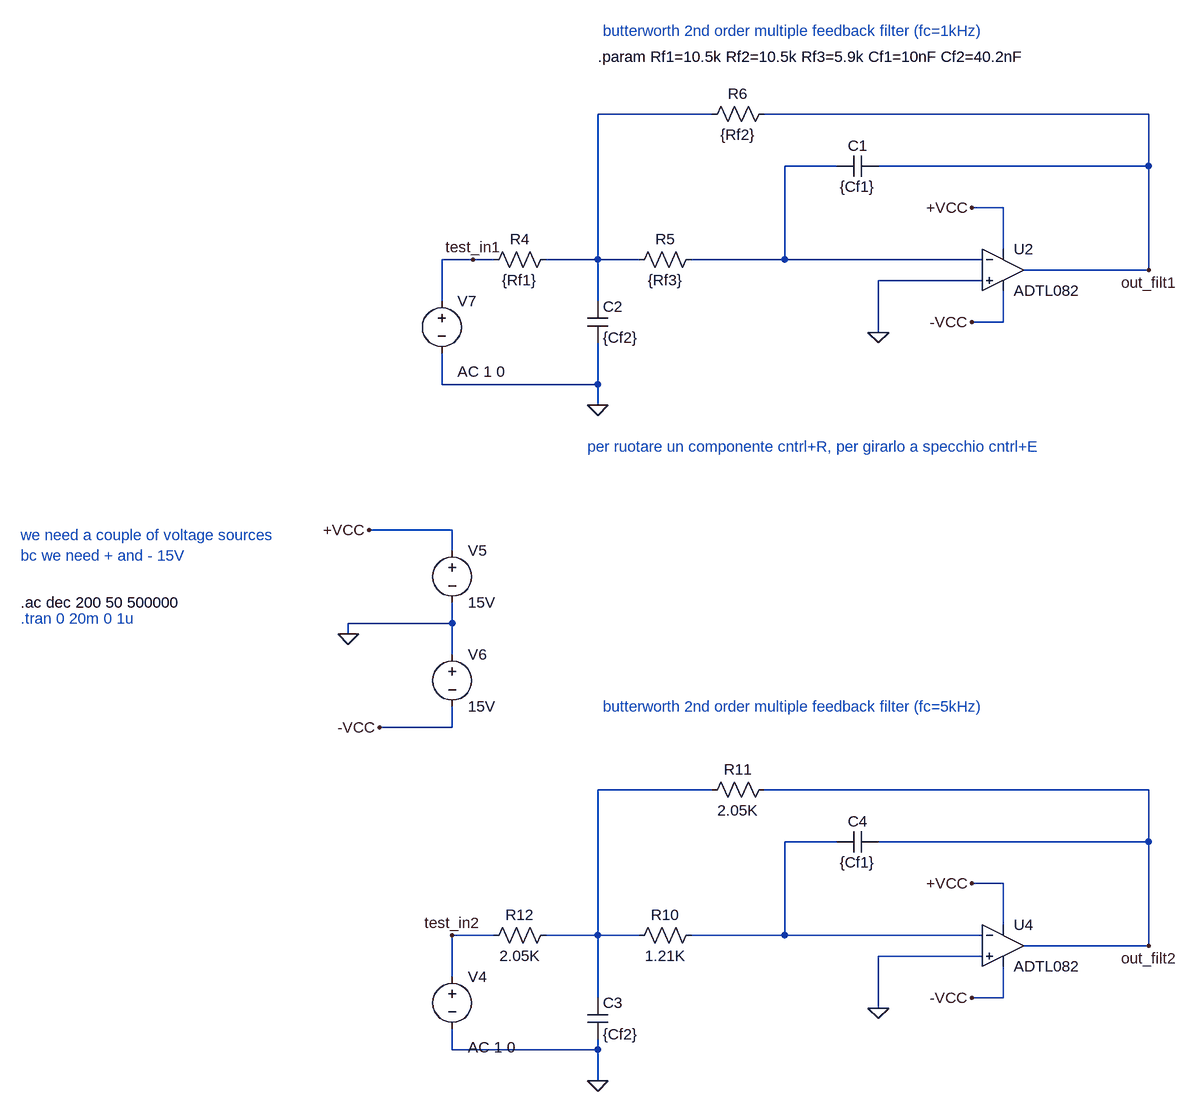
[diagram p0: schematic bode.asc]
bode.asc, the LTspice schematic file:
Version 4
SHEET 1 3368 1708
WIRE 1296 -144 1120 -144
WIRE 1968 -144 1376 -144
WIRE 1488 -64 1408 -64
WIRE 1968 -64 1968 -144
WIRE 1968 -64 1552 -64
WIRE 1744 0 1696 0
WIRE 1744 64 1744 0
WIRE 928 80 880 80
WIRE 960 80 928 80
WIRE 1120 80 1120 -144
WIRE 1120 80 1040 80
WIRE 1184 80 1120 80
WIRE 1408 80 1408 -64
WIRE 1408 80 1264 80
WIRE 1712 80 1408 80
WIRE 1968 96 1968 -64
WIRE 1968 96 1776 96
WIRE 1712 112 1552 112
WIRE 880 144 880 80
WIRE 1120 144 1120 80
WIRE 1744 176 1744 128
WIRE 1744 176 1696 176
WIRE 1552 192 1552 112
WIRE 880 272 880 224
WIRE 1120 272 1120 208
WIRE 1120 272 880 272
WIRE 1120 304 1120 272
WIRE 896 496 768 496
WIRE 896 528 896 496
WIRE 896 640 896 608
WIRE 896 640 736 640
WIRE 736 656 736 640
WIRE 896 688 896 640
WIRE 896 800 896 768
WIRE 896 800 784 800
WIRE 1296 896 1120 896
WIRE 1968 896 1376 896
WIRE 1488 976 1408 976
WIRE 1968 976 1968 896
WIRE 1968 976 1552 976
WIRE 1744 1040 1696 1040
WIRE 1744 1104 1744 1040
WIRE 960 1120 896 1120
WIRE 1120 1120 1120 896
WIRE 1120 1120 1040 1120
WIRE 1184 1120 1120 1120
WIRE 1408 1120 1408 976
WIRE 1408 1120 1264 1120
WIRE 1712 1120 1408 1120
WIRE 1968 1136 1968 976
WIRE 1968 1136 1776 1136
WIRE 1712 1152 1552 1152
WIRE 896 1184 896 1120
WIRE 1120 1216 1120 1120
WIRE 1744 1216 1744 1168
WIRE 1744 1216 1696 1216
WIRE 1552 1232 1552 1152
WIRE 896 1296 896 1264
WIRE 1120 1296 1120 1280
WIRE 1120 1296 896 1296
WIRE 1120 1344 1120 1296
FLAG 1696 176 -VCC
FLAG 1696 0 +VCC
FLAG 736 656 0
FLAG 768 496 +VCC
FLAG 784 800 -VCC
FLAG 1120 304 0
FLAG 1968 96 out_filt1
FLAG 1552 192 0
FLAG 1696 1216 -VCC
FLAG 1696 1040 +VCC
FLAG 1120 1344 0
FLAG 1968 1136 out_filt2
FLAG 1552 1232 0
FLAG 928 80 test_in1
FLAG 896 1120 test_in2
SYMBOL OpAmps\\ADTL082 1744 32 R0
SYMATTR InstName U2
SYMBOL voltage 896 512 R0
WINDOW 123 0 0 Left 0
WINDOW 39 0 0 Left 0
SYMATTR InstName V5
SYMATTR Value 15V
SYMBOL voltage 896 672 R0
WINDOW 123 0 0 Left 0
WINDOW 39 0 0 Left 0
SYMATTR InstName V6
SYMATTR Value 15V
SYMBOL res 1280 64 R90
WINDOW 0 0 56 VBottom 2
WINDOW 3 32 56 VTop 2
SYMATTR InstName R5
SYMATTR Value {Rf3}
SYMBOL cap 1104 144 R0
SYMATTR InstName C2
SYMATTR Value {Cf2}
SYMBOL cap 1552 -80 R90
WINDOW 0 0 32 VBottom 2
WINDOW 3 32 32 VTop 2
SYMATTR InstName C1
SYMATTR Value {Cf1}
SYMBOL res 1392 -160 R90
WINDOW 0 0 56 VBottom 2
WINDOW 3 32 56 VTop 2
SYMATTR InstName R6
SYMATTR Value {Rf2}
SYMBOL res 1056 64 R90
WINDOW 0 0 56 VBottom 2
WINDOW 3 32 56 VTop 2
SYMATTR InstName R4
SYMATTR Value {Rf1}
SYMBOL OpAmps\\ADTL082 1744 1072 R0
SYMATTR InstName U4
SYMBOL res 1280 1104 R90
WINDOW 0 0 56 VBottom 2
WINDOW 3 32 56 VTop 2
SYMATTR InstName R10
SYMATTR Value 1.21K
SYMBOL cap 1104 1216 R0
SYMATTR InstName C3
SYMATTR Value {Cf2}
SYMBOL cap 1552 960 R90
WINDOW 0 0 32 VBottom 2
WINDOW 3 32 32 VTop 2
SYMATTR InstName C4
SYMATTR Value {Cf1}
SYMBOL res 1392 880 R90
WINDOW 0 0 56 VBottom 2
WINDOW 3 32 56 VTop 2
SYMATTR InstName R11
SYMATTR Value 2.05K
SYMBOL res 1056 1104 R90
WINDOW 0 0 56 VBottom 2
WINDOW 3 32 56 VTop 2
SYMATTR InstName R12
SYMATTR Value 2.05K
SYMBOL voltage 896 1168 R0
WINDOW 123 24 124 Left 2
WINDOW 39 0 0 Left 0
SYMATTR Value2 AC 1 0
SYMATTR InstName V4
SYMATTR Value ""
SYMBOL voltage 880 128 R0
WINDOW 123 24 124 Left 2
WINDOW 39 0 0 Left 0
SYMATTR Value2 AC 1 0
SYMATTR InstName V7
SYMATTR Value ""
TEXT 232 504 Left 2 ;we need a couple of voltage sources\nbc we need + and - 15V
TEXT 1104 368 Left 2 ;per ruotare un componente cntrl+R, per girarlo a specchio cntrl+E
TEXT 232 632 Left 2 ;.tran 0 20m 0 1u
TEXT 1120 -232 Left 2 !.param Rf1=10.5k Rf2=10.5k Rf3=5.9k Cf1=10nF Cf2=40.2nF
TEXT 1128 -272 Left 2 ;butterworth 2nd order multiple feedback filter (fc=1kHz)
TEXT 1128 768 Left 2 ;butterworth 2nd order multiple feedback filter (fc=5kHz)
TEXT 232 608 Left 2 !.ac dec 200 50 500000

The netlist it stands for:
* bode.asc
XU2 0 N002 +VCC -VCC out_filt1 ADTL082  ; pins In+ In- V+ V- OUT
V5 +VCC 0 15V
V6 0 -VCC 15V
R5 N002 N001 {Rf3}
C2 N001 0 {Cf2}
C1 out_filt1 N002 {Cf1}
R6 out_filt1 N001 {Rf2}
R4 N001 test_in1 {Rf1}
XU4 0 N004 +VCC -VCC out_filt2 ADTL082  ; pins In+ In- V+ V- OUT
R10 N004 N003 1.21K
C3 N003 0 {Cf2}
C4 out_filt2 N004 {Cf1}
R11 out_filt2 N003 2.05K
R12 N003 test_in2 2.05K
V4 test_in2 0 AC 1 0
V7 test_in1 0 AC 1 0
* we need a couple of voltage sources
* bc we need + and - 15V
* per ruotare un componente cntrl+R, per girarlo a specchio cntrl+E
* .tran 0 20m 0 1u
.param Rf1=10.5k Rf2=10.5k Rf3=5.9k Cf1=10nF Cf2=40.2nF
* butterworth 2nd order multiple feedback filter (fc=1kHz)
* butterworth 2nd order multiple feedback filter (fc=5kHz)
.ac dec 200 50 500000
.lib ADI.lib
.backanno
.end